# Altium project LM2587_BoostConverter.PrjPcb
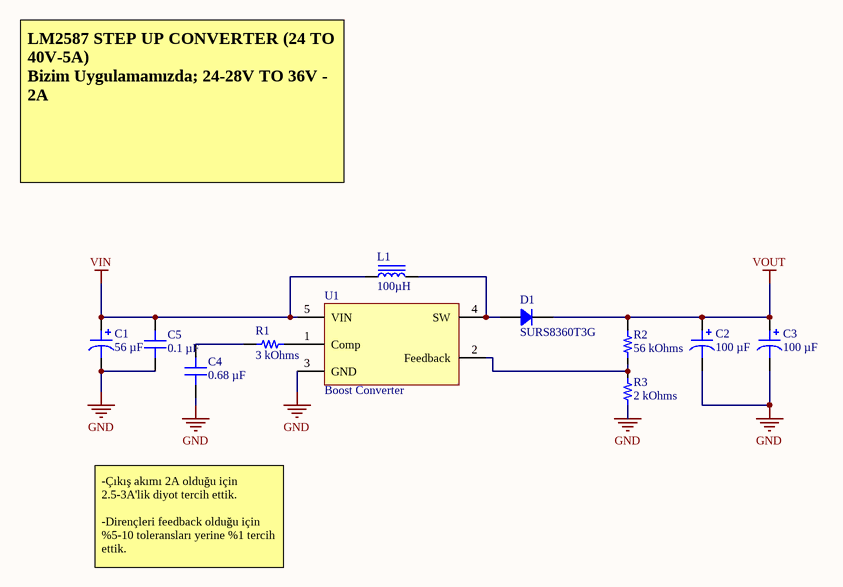
[diagram p0: LM2587_BoostConverter.SchDoc]
1 sheet, 11 parts. Net scope: global (net labels, ports and power ports of the same name join across sheets).
Board file: LM2587_BoostConverter.PcbDoc

## Sheet LM2587_BoostConverter.SchDoc
size A4; Date: 21.11.2022; Engineer: Burak Gonulbagi; DocumentNumber: 1; Revision: 00; SheetNumber: 1; SheetTotal: 1; SheetSize: A4

### Parts
C1  56 µF  [CAP ALSMD 6.6MM H7.7MM]
C2  100 µF  [CAP ALSMD 8.3MM H10.5MM]
C3  100 µF  [CAP ALSMD 8.3MM H10.5MM]
C4  0.68 µF  [CAP 0805_2012]
C5  0.1 µF  [CAP 0805_2012]
D1  SURS8360T3G  [DO214AB SMC]
L1  100µH  [7447070]
R1  3 kOhms  [RES 0805_2012]
R2  56 kOhms  [RES 0805_2012]
R3  2 kOhms  [RES 0805_2012]
U1  Boost Converter  [D2PAK]

### Nets
GND: C1.2 C2.2 C3.2 C4.1 C5.1 R3.1 U1.3(GND)
VIN: C1.1 C5.2 L1.1 U1.5(VIN)
VOUT: C2.1 C3.1 D1.2 R2.2
NetC4_2: C4.2 R1.1
NetD1_1: D1.1 L1.2 U1.4(SW)
NetR1_2: R1.2 U1.1(Comp)
NetR2_1: R2.1 R3.2 U1.2(Feedback)

### Notes on the sheet
- LM2587 STEP UP CONVERTER (24 TO 40V-5A)
  Bizim Uygulamamızda; 24-28V TO 36V - 2A
- -Çıkış akımı 2A olduğu için 2.5-3A'lik diyot tercih ettik.
  -Dirençleri feedback olduğu için %5-10 toleransları yerine %1 tercih ettik.
- Engineer:
- Document Number:
- Size:
- Sheet
- Revision:
- /
- File:

### Library data of the parts
C1 = UUD1V560MCL1GS: CAP ALUM 56UF 20% 35V SMD; manufacturer: Nichicon; Impedance: 340 mOhms; Lifetime @ Temp.: 2000 Hrs @ 105°C; Polarization: Polar; Ripple Current @ High Frequency: 280 mA @ 100 kHz; Ripple Current @ Low Frequency: 140 mA @ 120 Hz; Surface Mount Land Size: 0.260" L x 0.260" W (6.60mm x 6.60mm); Part Number: UUD1V560MCL1GS; Applications: Automotive; Capacitance: 56 µF; componentlink1description: Datasheet; componentlink1url: http://nichicon-us.com/english/products/pdfs/e-uud.pdf; componentlink2description: DigiKey Link; componentlink2url: https://www.digikey.com/en/products/detail/nichicon/UUD1V560MCL1GS/590029; Device Package: Radial, Can - SMD; Height - Seated (Max): 0.303" (7.70mm); lastupdated: 19.09.2022 14:00:49; Lifecycle Status: Active; Minimum Order: 1; Mounting Type: Surface Mount; Operating Temperature: -55°C ~ 105°C; Package / Case: Radial, Can - SMD; packaging: TapeAndReel; partid: 27263; Part Status: Active; price: 0.17; Ratings: AEC-Q200; series: UUD; Size / Dimension: 0.248" Dia (6.30mm); Supplier 1: DigiKey; Supplier Part Number 1: 493-2288-1-ND; Tolerance: ±20%; value: 56 µF; Voltage - Rated: 35 V
C2 C3 = UWT1H101MNL1GS: CAP ALUM 100UF 20% 50V SMD; manufacturer: Nichicon; Lifetime @ Temp.: 1000 Hrs @ 105°C; Polarization: Polar; Ripple Current @ High Frequency: 210 mA @ 10 kHz; Ripple Current @ Low Frequency: 140 mA @ 120 Hz; Surface Mount Land Size: 0.327" L x 0.327" W (8.30mm x 8.30mm); Part Number: UWT1H101MNL1GS; Applications: General Purpose; Capacitance: 100 µF; componentlink1description: Datasheet; componentlink1url: https://products.nichicon.co.jp/en/pdf/XJA043/e-uwt.pdf; componentlink2description: DigiKey Link; componentlink2url: https://www.digikey.com/en/products/detail/nichicon/UWT1H101MNL1GS/589967; Device Package: Radial, Can - SMD; Height - Seated (Max): 0.413" (10.50mm); lastupdated: 19.09.2022 14:00:32; Lifecycle Status: Active; Minimum Order: 1; Mounting Type: Surface Mount; Operating Temperature: -55°C ~ 105°C; Package / Case: Radial, Can - SMD; packaging: TapeAndReel; partid: 7453; Part Status: Active; price: 0.17; series: UWT; Size / Dimension: 0.315" Dia (8.00mm); Supplier 1: DigiKey; Supplier Part Number 1: 493-2226-1-ND; Tolerance: ±20%; value: 100 µF; Voltage - Rated: 50 V
C4 = CGA4J3X7R1H684K125AB: CAP CER 0.68UF 50V X7R 0805; manufacturer: TDK Corporation; Tolerance: ±10%; Part Number: CGA4J3X7R1H684K125AB; Value: 0.68 µF; Applications: Automotive; Capacitance: 0.68 µF; componentlink1description: Datasheet; componentlink1url: https://product.tdk.com/info/en/catalog/datasheets/mlcc_automotive_general_en.pdf?ref_disty=digikey; componentlink2description: DigiKey Link; componentlink2url: https://www.digikey.com/en/products/detail/tdk-corporation/CGA4J3X7R1H684K125AB/2672853; Device Package: 0805 (2012 Metric); lastupdated: 19.09.2022 13:04:00; Lifecycle Status: Active; Minimum Order: 1; Mounting Type: Surface Mount, MLCC; Operating Temperature: -55°C ~ 125°C; Package / Case: 0805 (2012 Metric); packaging: TapeAndReel; partid: 13295; Part Status: Active; price: 0.08; Ratings: AEC-Q200; series: CGA; Size / Dimension: 0.079" L x 0.049" W (2.00mm x 1.25mm); Supplier 1: DigiKey; Supplier Part Number 1: 445-6960-1-ND; Temperature Coefficient: X7R; Thickness (Max): 0.057" (1.45mm); Voltage - Rated: 50V
C5 = CC0805MRX7R9BB104: CAP CER 0.1UF 50V X7R 0805; manufacturer: Yageo; Tolerance: ±20%; Part Number: CC0805MRX7R9BB104; Value: 0.1 µF; Applications: General Purpose; Capacitance: 0.1 µF; componentlink1description: Datasheet; componentlink1url: https://www.yageo.com/upload/media/product/productsearch/datasheet/mlcc/UPY-GPHC_X7R_6.3V-to-50V_18.pdf; componentlink2description: DigiKey Link; componentlink2url: https://www.digikey.com/en/products/detail/yageo/CC0805MRX7R9BB104/5884281; Device Package: 0805 (2012 Metric); lastupdated: 19.09.2022 13:04:26; Lifecycle Status: Active; Minimum Order: 1; Mounting Type: Surface Mount, MLCC; Operating Temperature: -55°C ~ 125°C; Package / Case: 0805 (2012 Metric); packaging: TapeAndReel; partid: 2475; Part Status: Active; price: 0.02; series: CC; Size / Dimension: 0.079" L x 0.049" W (2.00mm x 1.25mm); Supplier 1: DigiKey; Supplier Part Number 1: 311-4351-1-ND; Temperature Coefficient: X7R; Thickness (Max): 0.037" (0.95mm); Voltage - Rated: 50V
D1 = SURS8360T3G: DIODE GEN PURP 600V 3A SMC; Manufacturer: ON Semiconductor; Current - Reverse Leakage @ Vr: 10µA @ 600V; Diode Type: Standard; Reverse Recovery Time (trr): 75ns; Speed: Fast Recovery =< 500ns, > 200mA (Io); Voltage - Forward (Vf) (Max) @ If: 1.25V @ 3A; Part Number: SURS8360T3G; ComponentLink1Description: Datasheet; ComponentLink1URL: http://www.onsemi.com/pub/Collateral/MURS320T3-D.PDF; ComponentLink2Description: DigiKey Link; ComponentLink2URL: http://digikey.com/product-detail/en/on-semiconductor/SURS8360T3G/SURS8360T3GOSCT-ND/9087771; Current - Average Rectified (Io): 3A; LastUpdated: 19.09.2022 13:45:55; Lifecycle Status: Active; Minimum Order: 1; Mounting Type: Surface Mount; Operating Temperature - Junction: -65°C ~ 175°C; Package / Case: DO-214AB, SMC; Packaging: TapeAndReel; PartId: 348; Part Status: Active; Price: 0.30; Series: -; Supplier 1: DigiKey; Supplier Part Number 1: SURS8360T3GOSCT-ND; Supplier Device Package: SMC; Voltage - DC Reverse (Vr) (Max): 600V
L1 = CB2016T101KV: FIXED IND 100UH 170MA 5.85 OHM; Manufacturer: Taiyo Yuden; Current Rating (Amps): 90mA; Current - Saturation: 70mA; DC Resistance (DCR): 5.85Ohm Max; Frequency - Self Resonant: 8MHz; Inductance Frequency - Test: 796kHz; Material - Core: Ferrite; Shielding: Unshielded; Tolerance: ±10%; Type: Wirewound; Part Number: CB2016T101KV; ComponentLink1Description: Datasheet; ComponentLink1URL: https://ds.yuden.co.jp/TYCOMPAS/ut/detail?pn=CB2016T101KV  &u=M; ComponentLink2Description: DigiKey Link; ComponentLink2URL: http://digikey.com/product-detail/en/taiyo-yuden/CB2016T101KV/587-3680-1-ND/4694189; Device Package: 0806 (2016 Metric); Height - Seated (Max): 0.071" (1.80mm); Inductance: 100µH; LastUpdated: 19.09.2022 13:59:35; Lifecycle Status: Active; Minimum Order: 1; Mounting Type: Surface Mount; Operating Temperature: -40°C ~ 105°C; Package / Case: 0806 (2016 Metric); Packaging: TapeAndReel; PartId: 2807; Part Status: Active; Price: 0.10; Series: CB; Size / Dimension: 0.079" L x 0.063" W (2.00mm x 1.60mm); Supplier 1: DigiKey; Supplier Part Number 1: 587-3680-1-ND; Supplier Device Package: 0806 (2016 Metric); Value: 100µH
R1 = ERJ-6ENF3001V: RES SMD 3K OHM 1% 1/8W 0805; Manufacturer: Panasonic Electronic Components; Power (Watts): 0.125W, 1/8W; Temperature Coefficient: ±100ppm/°C; Part Number: ERJ-6ENF3001V; Value: 3 kOhms; ComponentLink1Description: Datasheet; ComponentLink1URL: https://industrial.panasonic.com/cdbs/www-data/pdf/RDA0000/AOA0000C304.pdf; ComponentLink2Description: DigiKey Link; ComponentLink2URL: https://www.digikey.com/en/products/detail/panasonic-electronic-components/ERJ-6ENF3001V/366038; Composition: Thick Film; Device Package: 0805 (2012 Metric); Features: Automotive AEC-Q200; Height - Seated (Max): 0.028" (0.70mm); LastUpdated: 19.09.2022 13:36:50; Lifecycle Status: Active; Minimum Order: 1; Number of Terminations: 2; Operating Temperature: -55°C ~ 155°C; Package / Case: 0805 (2012 Metric); Packaging: TapeAndReel; PartId: 30109; Part Status: Active; Price: 0.01; Ratings: AEC-Q200; Resistance: 3 kOhms; Series: ERJ-6EN; Size / Dimension: 0.079" L x 0.049" W (2.00mm x 1.25mm); Supplier 1: DigiKey; Supplier Part Number 1: P3.0KCCT-ND; Supplier Device Package: 0805; Tolerance: ±1%
R2 = CRGP0805F56K: RES 56K OHM 1% 1/3W 0805; Manufacturer: TE Connectivity Passive Product; Power (Watts): 0.333W, 1/3W; Temperature Coefficient: ±100ppm/°C; Part Number: CRGP0805F56K; Value: 56 kOhms; ComponentLink1Description: Datasheet; ComponentLink1URL: https://www.te.com/commerce/DocumentDelivery/DDEController?Action=srchrtrv&DocNm=9-1773463-9&DocType=DS&DocLang=English; ComponentLink2Description: DigiKey Link; ComponentLink2URL: https://www.digikey.com/en/products/detail/te-connectivity-passive-product/CRGP0805F56K/8577100; Composition: Thick Film; Device Package: 0805 (2012 Metric); Features: Pulse Withstanding; Height - Seated (Max): 0.026" (0.65mm); LastUpdated: 19.09.2022 13:36:56; Lifecycle Status: Active; Minimum Order: 1; Number of Terminations: 2; Operating Temperature: -55°C ~ 155°C; Package / Case: 0805 (2012 Metric); Packaging: TapeAndReel; PartId: 28743; Part Status: Active; Price: 0.03; Resistance: 56 kOhms; Series: CRGP; Size / Dimension: 0.079" L x 0.049" W (2.00mm x 1.25mm); Supplier 1: DigiKey; Supplier Part Number 1: A130498CT-ND; Supplier Device Package: 0805; Tolerance: ±1%
R3 = RCS08052K00FKEA: RES SMD 2K OHM 1% 0.4W 0805; Manufacturer: Vishay Dale; Power (Watts): 0.4W, 2/5W; Temperature Coefficient: ±100ppm/°C; Part Number: RCS08052K00FKEA; Value: 2 kOhms; ComponentLink1Description: Datasheet; ComponentLink1URL: http://www.vishay.com/docs/20065/rcse3.pdf; ComponentLink2Description: DigiKey Link; ComponentLink2URL: https://www.digikey.com/en/products/detail/vishay-dale/RCS08052K00FKEA/5866986; Composition: Thick Film; Device Package: 0805 (2012 Metric); Features: Automotive AEC-Q200, Pulse Withstanding; Height - Seated (Max): 0.020" (0.50mm); LastUpdated: 19.09.2022 13:36:59; Lifecycle Status: Active; Minimum Order: 1; Number of Terminations: 2; Operating Temperature: -55°C ~ 155°C; Package / Case: 0805 (2012 Metric); Packaging: TapeAndReel; PartId: 27786; Part Status: Active; Price: 0.03; Ratings: AEC-Q200; Resistance: 2 kOhms; Series: RCS e3; Size / Dimension: 0.079" L x 0.049" W (2.00mm x 1.25mm); Supplier 1: DigiKey; Supplier Part Number 1: 541-2840-1-ND; Supplier Device Package: 0805; Tolerance: ±1%
U1 = LM2587